# Altium schematic sheet A_Flotador.SchDoc
size A4; DocumentNumber: 1; SheetNumber: 1; SheetTotal: 1
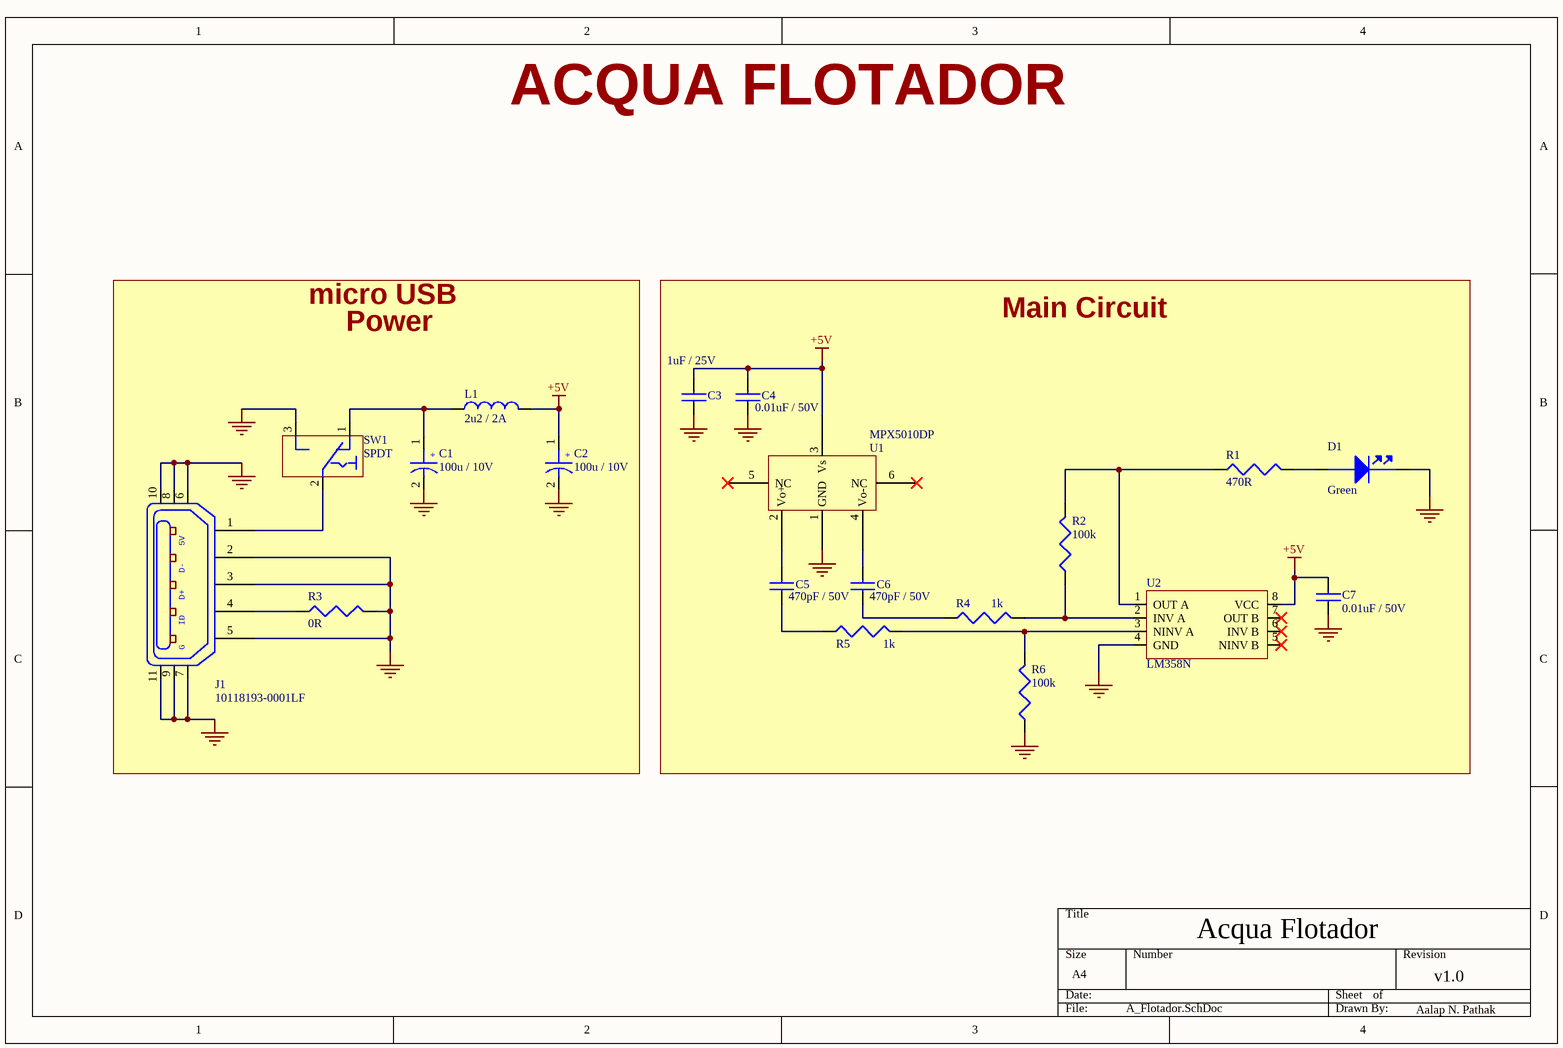
[diagram p0: A_Flotador.SchDoc]

## Parts
C1  100u / 10V  [C_ALU_C_SIZE]
C2  100u / 10V  [C_ALU_C_SIZE]
C3  1uF / 25V  [C0805]
C4  0.01uF / 50V  [C0805]
C5  470pF / 50V  [C0805]
C6  470pF / 50V  [C0805]
C7  0.01uF / 50V  [C0805]
D1  Green  [LED_0603]
J1  10118193-0001LF  [MicroUSB]
L1  2u2 / 2A  [C1210_IND]
R1  470R  [R0805]
R2  100k  [R0805]
R3  0R  [R0805]
R4  1k  [R0805]
R5  1k  [R0805]
R6  100k  [R0805]
SW1  SPDT  [SPDT]
U1  MPX5010DP  [MPX5010DP]
U2  LM358N  [LM358N]

## Blocks framed on the sheet
Main Circuit: C3-C7 D1 R1 R2 R4-R6 U1 U2

## Nets
+5V: C2.1 C3.2 C4.2 C7.2 L1.2 U1.3(Vs) U2.8(VCC)
GND: C1.2 C2.2 C3.1 C4.1 C7.1 D1.1(Cathode) J1.2 J1.3 J1.5 J1.6 J1.7 J1.8 J1.9 J1.10 J1.11 R3.2 R6.1 SW1.3 U1.1(GND) U2.4(GND)
NetC1_1: C1.1 L1.1 SW1.1
NetC5_1: C5.1 R5.1
NetC5_2: C5.2 U1.2(Vo+)
NetC6_1: C6.1 R4.1
NetC6_2: C6.2 U1.4(Vo-)
NetD1_2: D1.2(Anode) R1.2
NetJ1_1: J1.1 SW1.2
NetJ1_4: J1.4 R3.1
NetR1_1: R1.1 R2.2 U2.1(OUT_A)
NetR2_1: R2.1 R4.2 U2.2(INV_A)
NetR5_2: R5.2 R6.2 U2.3(NINV_A)

Not connected (* = marked no-connect by the designer): U1 5(NC)* 6(NC)*; U2 5(NINV_B)* 6(INV_B)* 7(OUT_B)*

## Notes on the sheet
- ACQUA FLOTADOR
- micro USB
- Power
- Acqua Flotador
- v1.0
- Aalap N. Pathak
- (in symbol 10118193-0001LF) 5V; D-; D+; ID; G
- (in symbol EEE-1AA101WR) +

## Library data of the parts
C1 C2 = EEE-1AA101WR: Cap Aluminum 100uF 10V 20% (5 X 5.4mm) SMD 50mA 1000 hr 85°C T/R; Manufacturer: Panasonic; Life (Hours): 1000Hour; Supplier 1: Digi-Key; Supplier Part Number 1: PCE3867CT-ND; Manufacturer Part Number: EEE-1AA101WR; Stock 1: 121782; Pricing 1: 1 = 0.32000, 10 = 0.22100, 100 = 0.13280, 500 = 0.09964 (USD); RoHS: Yes; Mount: Surface Mount,PCB; Case/Package: Radial; Contact Plating: Tin; Min Operating Temperature: -40°C; Max Operating Temperature: 85°C; Capacitance: 100uF; Tolerance: 20%; Ripple Current: 50mA; Voltage Rating: 10V; Packaging: Tape and Reel; Package Quantity: 1; Voltage Rating (DC): 10V; Termination: SMD/SMT; Ripple Current (AC): 50mA; Diameter: 5mm; Length: 5.5mm; Height: 5.4mm; Height - Seated (Max): 0.213inch; Radiation Hardening: No; Lead Free: Lead Free; REACH SVHC: Unknown; ComponentLink1URL: https://datasheet.ciiva.com/26945/getdatasheetpartid-169213-26945071.pdf?src-supplier=Verical; ComponentLink1Description: https://datasheet.ciiva.com/26945/getdatasheetpartid-169213-26945071.pdf?src-supplier=Verical; ComponentLink2URL: https://datasheet.ciiva.com/2983/aba0000ce2-2983906.pdf?src-supplier=Avnet; ComponentLink2Description: https://datasheet.ciiva.com/2983/aba0000ce2-2983906.pdf?src-supplier=Avnet; ComponentLink3URL: https://datasheet.ciiva.com/24027/aba0000ce2-40801-24027541.pdf?src-supplier=Mouser; ComponentLink3Description: https://datasheet.ciiva.com/24027/aba0000ce2-40801-24027541.pdf?src-supplier=Mouser; ComponentLink4URL: https://datasheet.ciiva.com/30075/11aba0000ce2-30075303.pdf?src-supplier=Onlinecomponents.com; ComponentLink4Description: https://datasheet.ciiva.com/30075/11aba0000ce2-30075303.pdf?src-supplier=Onlinecomponents.com; ComponentLink5URL: https://datasheet.ciiva.com/16427/aba0000ce2-16427544.pdf?src-supplier=Future+Electronics; ComponentLink5Description: https://datasheet.ciiva.com/16427/aba0000ce2-16427544.pdf?src-supplier=Future+Electronics; ComponentLink6URL: https://datasheet.ciiva.com/14598/70255710-14598233.pdf?src-supplier=Allied+Electronics; ComponentLink6Description: https://datasheet.ciiva.com/14598/70255710-14598233.pdf?src-supplier=Allied+Electronics; ComponentLink7URL: https://datasheet.ciiva.com/14605/70255710-14605689.pdf?src-supplier=Allied+Electronics; ComponentLink7Description: https://datasheet.ciiva.com/14605/70255710-14605689.pdf?src-supplier=Allied+Electronics; ComponentLink8URL: https://datasheet.ciiva.com/11673/aba0000ce2-11673882.pdf?src-supplier=Avnet; ComponentLink8Description: https://datasheet.ciiva.com/11673/aba0000ce2-11673882.pdf?src-supplier=Avnet
C3 = C2012X5R1E105K125AA: CAP CER 1UF 25V X5R 0805; Manufacturer: TDK; Dielectric Material: Ceramic; Tolerance: 10%; Supplier 1: Digi-Key; Supplier Part Number 1: 445-1419-1-ND; Manufacturer Part Number: C2012X5R1E105K125AA; Stock 1: 57325; Pricing 1: 1 = 0.27000, 10 = 0.18200, 100 = 0.09230, 500 = 0.06314, 1000 = 0.05586 (USD); RoHS: Yes; Mount: Surface Mount; Case/Package: 0805; Number of Pins: 2; Weight: 0.000194oz; Case Code (Metric): 2012; Case Code (Imperial): 0805; Min Operating Temperature: -55°C; Max Operating Temperature: 85°C; Capacitance: 1uF; Voltage Rating: 25V; Packaging: Tape and Reel; Voltage Rating (DC): 25V; Dielectric: X5R; Termination: SMD/SMT; Package Quantity: 2000; Composition: Ceramic; Voltage: 25V; Length: 2mm; Height: 1.25mm; Depth: 1.25mm; Width: 0.049inch; Thickness: 0.057inch; Radiation Hardening: No; Lead Free: Lead Free; REACH SVHC: No SVHC; ComponentLink1URL: https://datasheet.ciiva.com/11787/0900766b80c1bb00-11787608.pdf?src-supplier=RSComponents; ComponentLink1Description: https://datasheet.ciiva.com/11787/0900766b80c1bb00-11787608.pdf?src-supplier=RSComponents; ComponentLink2URL: https://datasheet.ciiva.com/16449/e412-c-16449595.pdf?src-supplier=Future+Electronics; ComponentLink2Description: https://datasheet.ciiva.com/16449/e412-c-16449595.pdf?src-supplier=Future+Electronics; ComponentLink3URL: https://datasheet.ciiva.com/28602/1744655-28602171.pdf?src-supplier=Element14; ComponentLink3Description: https://datasheet.ciiva.com/28602/1744655-28602171.pdf?src-supplier=Element14; ComponentLink4URL: https://datasheet.ciiva.com/15192/getdatasheetpartid-726707-15192140.pdf?src-supplier=Verical; ComponentLink4Description: https://datasheet.ciiva.com/15192/getdatasheetpartid-726707-15192140.pdf?src-supplier=Verical
C4 C7 = C0805C103K5RACTU: CAP CER 0.01UF 50V X7R 0805; Manufacturer: KEMET; Capacitance: 10nF; Tolerance: 10%; Supplier 1: Digi-Key; Supplier Part Number 1: 399-1158-1-ND; Manufacturer Part Number: C0805C103K5RACTU; Stock 1: 3202760; Pricing 1: 1 = 0.15000, 10 = 0.10500, 100 = 0.04950, 500 = 0.03474, 1000 = 0.02876 (USD); RoHS: Yes; Mount: Surface Mount; Case/Package: 0805; Case Code (Imperial): 0805; Case Code (Metric): 2012; Contact Plating: Tin,Matte; Min Operating Temperature: -55°C; Max Operating Temperature: 125°C; Packaging: Tape and Reel; Voltage Rating (DC): 50V; Dielectric: X7R; Package Quantity: 4000; Voltage Rating: 50V; Termination: SMD/SMT; Voltage: 50V; Length: 2mm; Height: 0.78mm; Width: 1.2mm; Lead Pitch: 0.75mm; Depth: 1.25mm; Radiation Hardening: No; ComponentLink1URL: http://www.onlinecomponents.com/productFiles/mf-KEM/kem_c1002_x7r_smd.pdf?src-supplier=Onlinecomponents.com; ComponentLink1Description: http://www.onlinecomponents.com/productFiles/mf-KEM/kem_c1002_x7r_smd.pdf?src-supplier=Onlinecomponents.com; ComponentLink2URL: http://components.arrow.com/part/dataview/0323_00011329?src-supplier=Arrow+Europe; ComponentLink2Description: http://components.arrow.com/part/dataview/0323_00011329?src-supplier=Arrow+Europe; ComponentLink3URL: https://www.verical.com/server-webapp/html/getDatasheet?partID=293414&src-supplier=Verical; ComponentLink3Description: https://www.verical.com/server-webapp/html/getDatasheet?partID=293414&src-supplier=Verical; ComponentLink4URL: http://www.farnell.com/datasheets/2315425.pdf?src-supplier=Farnell; ComponentLink4Description: http://www.farnell.com/datasheets/2315425.pdf?src-supplier=Farnell; ComponentLink5URL: http://www.kemet.com/Lists/ProductCatalog/Attachments/53/KEM_C1002_X7R_SMD.pdf?src-supplier=Avnet; ComponentLink5Description: http://www.kemet.com/Lists/ProductCatalog/Attachments/53/KEM_C1002_X7R_SMD.pdf?src-supplier=Avnet; ComponentLink6URL: http://www.farnell.com/datasheets/2121238.pdf?src-supplier=Element14; ComponentLink6Description: http://www.farnell.com/datasheets/2121238.pdf?src-supplier=Element14; ComponentLink7URL: https://api.kemet.com/component-edge/download/datasheet/C0805C103K5RACTU.pdf?src-supplier=Digi-Key; ComponentLink7Description: https://api.kemet.com/component-edge/download/datasheet/C0805C103K5RACTU.pdf?src-supplier=Digi-Key
C5 C6 = C0805C471K5RACTU: CAP CER 470PF 50V X7R 0805; Manufacturer: KEMET; Dielectric Material: Ceramic; Tolerance: 10%; Dissipation Factor: 2.5%; Supplier 1: Digi-Key; Supplier Part Number 1: 399-1142-1-ND; Manufacturer Part Number: C0805C471K5RACTU; Stock 1: 229830; Pricing 1: 1 = 0.12000, 10 = 0.09000, 100 = 0.04030, 500 = 0.02876, 1000 = 0.02260 (USD); RoHS: Yes; Mount: Surface Mount; Case/Package: 0805; Number of Pins: 2; Case Code (Imperial): 0805; Case Code (Metric): 2012; Min Operating Temperature: -55°C; Max Operating Temperature: 125°C; Capacitance: 470pF; Packaging: Tape and Reel; Dielectric: X7R; Termination: SMD/SMT; Voltage Rating (DC): 50V; Package Quantity: 1; Voltage Rating: 50V; Voltage: 50V; Length: 2mm; Height: 0.78mm; Width: 1.2mm; Lead Pitch: 0.75mm; Depth: 1.25mm; Thickness: 0.035inch; Radiation Hardening: No; REACH SVHC: No SVHC; ComponentLink1URL: https://datasheet.ciiva.com/16624/datasheetpn-c0805c471k5ractu-16624899.pdf?src-supplier=Avnet+Europe; ComponentLink1Description: https://datasheet.ciiva.com/16624/datasheetpn-c0805c471k5ractu-16624899.pdf?src-supplier=Avnet+Europe; ComponentLink2URL: https://datasheet.ciiva.com/18193/getdatasheetpartid-344591-18193834.pdf?src-supplier=Verical; ComponentLink2Description: https://datasheet.ciiva.com/18193/getdatasheetpartid-344591-18193834.pdf?src-supplier=Verical; ComponentLink3URL: https://datasheet.ciiva.com/46446/1851736-46446251.pdf?src-supplier=Element14; ComponentLink3Description: https://datasheet.ciiva.com/46446/1851736-46446251.pdf?src-supplier=Element14; ComponentLink4URL: https://datasheet.ciiva.com/28614/kem-c1002-x7r-smd-28614760.pdf?src-supplier=Element14; ComponentLink4Description: https://datasheet.ciiva.com/28614/kem-c1002-x7r-smd-28614760.pdf?src-supplier=Element14
D1 = LGL29K-G2J1-24-Z: LED Uni-Color Green 572nm 2-Pin Chip 0603(1608Metric) T/R; Manufacturer: Osram Opto; Lens Color: White; Forward Current: 20mA; Forward Voltage: 2.2V; Luminous Intensity: 5.6mcd; Viewing Angle: 160°; Lens Style: Flat,Diffused,Colorless,Rectangular; Test Current: 2mA; Dominant Wavelength: 570nm; Luminous Flux: 0.012lm; Number of LEDs: 1; Lens Transparency: Diffused; Reverse Voltage: 12V; Lens Size: 0.8mm; Supplier 1: Digi-Key; Supplier Part Number 1: 475-2709-1-ND; Manufacturer Part Number: LGL29K-G2J1-24-Z; Stock 1: 129040; Pricing 1: 1 = 0.50000, 10 = 0.36300, 100 = 0.23730, 500 = 0.17054, 1000 = 0.13347, 2500 = 0.12235 (USD); RoHS: Yes; Mount: Surface Mount; Case/Package: 0603; Number of Pins: 2; Color: Green; Case Code (Metric): 1608; Case Code (Imperial): 0603; Min Operating Temperature: -40°C; Max Operating Temperature: 100°C; Illumination Color: Green; Packaging: Tape and Reel; Package Quantity: 5000; Number of Elements: 1; Length: 1.3mm; Height: 0.65mm; Width: 0.8mm; Depth: 0.8mm; Radiation Hardening: No; ComponentLink1URL: https://datasheet.ciiva.com/4689/g-l29k-39844-4689584.pdf?src-supplier=Mouser; ComponentLink1Description: https://datasheet.ciiva.com/4689/g-l29k-39844-4689584.pdf?src-supplier=Mouser; ComponentLink2URL: https://datasheet.ciiva.com/15198/getdatasheetpartid-571127-15198411.pdf?src-supplier=Verical; ComponentLink2Description: https://datasheet.ciiva.com/15198/getdatasheetpartid-571127-15198411.pdf?src-supplier=Verical; ComponentLink3URL: https://datasheet.ciiva.com/2112/00077107-0-2112887.pdf?src-supplier=Digi-Key; ComponentLink3Description: https://datasheet.ciiva.com/2112/00077107-0-2112887.pdf?src-supplier=Digi-Key; ComponentLink4URL: https://datasheet.ciiva.com/2112/00077107-0-2112888.pdf?src-supplier=Digi-Key; ComponentLink4Description: https://datasheet.ciiva.com/2112/00077107-0-2112888.pdf?src-supplier=Digi-Key; ComponentLink5URL: https://datasheet.ciiva.com/2112/00077107-0-2112886.pdf?src-supplier=Digi-Key; ComponentLink5Description: https://datasheet.ciiva.com/2112/00077107-0-2112886.pdf?src-supplier=Digi-Key
J1 = 10118193-0001LF: CONN RCPT USB2.0 MICRO B SMD R/A; Manufacturer: Amphenol FCI; Gender: Female; Connector Type: USB,Receptacle; Number of Contacts: 5; Insulation Resistance: 1GR; Number of Ports: 1; Current Rating: 1.8A; Max Voltage Rating (AC): 100V; Pitch: 0.65mm; Supplier 1: Digi-Key; Supplier Part Number 1: 609-4616-1-ND; Manufacturer Part Number: 10118193-0001LF; Stock 1: 150983; Pricing 1: 1 = 0.43000, 10 = 0.40500, 25 = 0.36440, 50 = 0.32400, 100 = 0.31040, 250 = 0.28344, 500 = 0.26994 (USD); RoHS: Yes; Mount: Surface Mount,Horizontal; Contact Material: Copper Alloy; Contact Plating: Gold; Color: Black; Number of Terminals: 5; Housing Material: Polymer; Min Operating Temperature: -55°C; Max Operating Temperature: 85°C; Termination: Solder; Orientation: Right Angle; Package Quantity: 1200; Packaging: Tape and Reel; Voltage Rating: 100V; Features: Shielded; Length: 7.86mm; Depth: 5.67mm; Radiation Hardening: No; Flammability Rating: UL94 V-0; ComponentLink1URL: https://datasheet.ciiva.com/851/10118193-851106.pdf?src-supplier=Digi-Key; ComponentLink1Description: https://datasheet.ciiva.com/851/10118193-851106.pdf?src-supplier=Digi-Key; ComponentLink2URL: https://datasheet.ciiva.com/14802/10118193-0001lf-webpage-14802386.pdf?src-supplier=Arrow; ComponentLink2Description: https://datasheet.ciiva.com/14802/10118193-0001lf-webpage-14802386.pdf?src-supplier=Arrow; ComponentLink3URL: https://datasheet.ciiva.com/26853/getdatasheetpartid-418618-26853893.pdf?src-supplier=Verical; ComponentLink3Description: https://datasheet.ciiva.com/26853/getdatasheetpartid-418618-26853893.pdf?src-supplier=Verical; ComponentLink4URL: https://datasheet.ciiva.com/4598/10118193ac-197151-4598799.pdf?src-supplier=Mouser; ComponentLink4Description: https://datasheet.ciiva.com/4598/10118193ac-197151-4598799.pdf?src-supplier=Mouser; ComponentLink5URL: https://datasheet.ciiva.com/851/10118193-851107.pdf?src-supplier=Digi-Key; ComponentLink5Description: https://datasheet.ciiva.com/851/10118193-851107.pdf?src-supplier=Digi-Key; ComponentLink6URL: https://datasheet.ciiva.com/851/10118193-851108.pdf?src-supplier=Digi-Key; ComponentLink6Description: https://datasheet.ciiva.com/851/10118193-851108.pdf?src-supplier=Digi-Key; ComponentLink7URL: https://datasheet.ciiva.com/14618/70236827-14618887.pdf?src-supplier=Allied+Electronics; ComponentLink7Description: https://datasheet.ciiva.com/14618/70236827-14618887.pdf?src-supplier=Allied+Electronics
L1 = L1210R2R2MDWIT: FIXED IND 2.2UH 2A 80 MOHM SMD; Manufacturer: KEMET; Core Material: Ferrite; Tolerance: 20%; Shielding: Unshielded; Self Resonant Frequency: 190MHz; DC Resistance (DCR): 80mR; Test Frequency: 100kHz; DC Current: 1.13A; Supplier 1: Digi-Key; Supplier Part Number 1: 399-9598-1-ND; Manufacturer Part Number: L1210R2R2MDWIT; Stock 1: 14739; Pricing 1: 1 = 0.55000, 10 = 0.47900, 100 = 0.34210, 500 = 0.28738 (USD); RoHS: Yes; Mount: Surface Mount; Case/Package: 1210; Case Code (Metric): 3225; Case Code (Imperial): 1210; Min Operating Temperature: -40°C; Max Operating Temperature: 105°C; Inductance: 2.2uH; Max DC Current: 2A; Package Quantity: 1000; Current Rating: 2A; Packaging: Tape and Reel; Inductance Tolerance: 20%; Composition: Wirewound,Ceramic; Termination: SMD/SMT; Military Standard: Not; Length: 0.126inch; Height: 2.5mm; Width: 0.098inch; Height - Seated (Max): 0.106inch; Depth: 2.7mm; Radiation Hardening: No; REACH SVHC: No SVHC; ComponentLink1URL: https://datasheet.ciiva.com/17280/f3115-17280270.pdf?src-supplier=Avnet+Europe; ComponentLink1Description: https://datasheet.ciiva.com/17280/f3115-17280270.pdf?src-supplier=Avnet+Europe; ComponentLink2URL: https://datasheet.ciiva.com/22685/27262-22685038.pdf?src-supplier=Element14; ComponentLink2Description: https://datasheet.ciiva.com/22685/27262-22685038.pdf?src-supplier=Element14; ComponentLink3URL: https://datasheet.ciiva.com/4957/f3115-4957838.pdf?src-supplier=Mouser; ComponentLink3Description: https://datasheet.ciiva.com/4957/f3115-4957838.pdf?src-supplier=Mouser; ComponentLink4URL: https://datasheet.ciiva.com/6691/f3115-6691487.pdf?src-supplier=Digi-Key; ComponentLink4Description: https://datasheet.ciiva.com/6691/f3115-6691487.pdf?src-supplier=Digi-Key; ComponentLink5URL: https://datasheet.ciiva.com/8512/f3115-8512543.pdf?src-supplier=Avnet; ComponentLink5Description: https://datasheet.ciiva.com/8512/f3115-8512543.pdf?src-supplier=Avnet
R1 = RC0805FR-07470RL: RES SMD 470 OHM 1% 1/8W 0805; Manufacturer: Yageo; Temperature Coefficient: 100ppm/°C; Voltage Rating (DC): 150V; Power Rating: 125mW; Supplier 1: Digi-Key; Supplier Part Number 1: 311-470CRCT-ND; Manufacturer Part Number: RC0805FR-07470RL; Stock 1: 1101328; Pricing 1: 1 = 0.10000, 10 = 0.04000, 100 = 0.01630, 1000 = 0.00731, 2500 = 0.00635 (USD); RoHS: Yes; Case/Package: 0805; Number of Pins: 2; Case Code (Metric): 2012; Case Code (Imperial): 0805; Min Operating Temperature: -55°C; Max Operating Temperature: 155°C; Resistance: 470R; Tolerance: 1%; Composition: Thick Film; Packaging: Tape and Reel; Package Quantity: 1; Voltage Rating: 150V; Number of Terminations: 2; Termination: SMD/SMT; Military Standard: Not; Max Power Dissipation: 125mW; Features: Moisture Resistant; Length: 2mm; Height: 0.5mm; Width: 1.25mm; Depth: 1.25mm; Lead Pitch: 0.4mm; REACH SVHC: Unknown; Lead Free: Lead Free; ComponentLink1URL: https://datasheet.ciiva.com/2457/pyu-r-int-thick-7-2457056.pdf?src-supplier=Digi-Key; ComponentLink1Description: https://datasheet.ciiva.com/2457/pyu-r-int-thick-7-2457056.pdf?src-supplier=Digi-Key; ComponentLink2URL: https://datasheet.ciiva.com/2457/pyu-r-int-thick-7-2457057.pdf?src-supplier=Digi-Key; ComponentLink2Description: https://datasheet.ciiva.com/2457/pyu-r-int-thick-7-2457057.pdf?src-supplier=Digi-Key; ComponentLink3URL: https://datasheet.ciiva.com/2457/pyu-r-int-thick-7-2457058.pdf?src-supplier=Digi-Key; ComponentLink3Description: https://datasheet.ciiva.com/2457/pyu-r-int-thick-7-2457058.pdf?src-supplier=Digi-Key; ComponentLink4URL: https://datasheet.ciiva.com/7941/444164-7941797.pdf?src-supplier=Element14; ComponentLink4Description: https://datasheet.ciiva.com/7941/444164-7941797.pdf?src-supplier=Element14; ComponentLink5URL: https://datasheet.ciiva.com/7941/444164-7941798.pdf?src-supplier=Element14; ComponentLink5Description: https://datasheet.ciiva.com/7941/444164-7941798.pdf?src-supplier=Element14; ComponentLink6URL: https://datasheet.ciiva.com/46447/444164-46447580.pdf?src-supplier=Element14; ComponentLink6Description: https://datasheet.ciiva.com/46447/444164-46447580.pdf?src-supplier=Element14; ComponentLink7URL: https://datasheet.ciiva.com/16745/rc0805-16745229.pdf?src-supplier=Future+Electronics; ComponentLink7Description: https://datasheet.ciiva.com/16745/rc0805-16745229.pdf?src-supplier=Future+Electronics
R2 R6 = RC0805FR-07100KL: RES SMD 100K OHM 1% 1/8W 0805; Manufacturer: Yageo; Resistance: 100kR; Temperature Coefficient: 100ppm/°C; Power Rating: 125mW; Voltage Rating (DC): 150V; Supplier 1: Digi-Key; Supplier Part Number 1: 311-100KCRCT-ND; Manufacturer Part Number: RC0805FR-07100KL; Stock 1: 7766985; Pricing 1: 1 = 0.10000, 10 = 0.03800, 100 = 0.01550, 1000 = 0.00694, 2500 = 0.00603 (USD); RoHS: Yes; Case/Package: 0805; Number of Pins: 2; Case Code (Metric): 2012; Case Code (Imperial): 0805; Min Operating Temperature: -55°C; Max Operating Temperature: 155°C; Composition: Thick Film; Tolerance: 1%; Packaging: Tape and Reel; Voltage Rating: 150V; Package Quantity: 1; Number of Terminations: 2; Termination: SMD/SMT; Military Standard: Not; Max Power Dissipation: 125mW; Features: Moisture Resistant; Length: 2mm; Height: 0.024inch; Width: 0.049inch; Depth: 1.25mm; Lead Pitch: 0.4mm; REACH SVHC: Unknown; Lead Free: Lead Free; ComponentLink1URL: https://datasheet.ciiva.com/11808/0900766b8106beab-11808858.pdf?src-supplier=RSComponents; ComponentLink1Description: https://datasheet.ciiva.com/11808/0900766b8106beab-11808858.pdf?src-supplier=RSComponents; ComponentLink2URL: https://datasheet.ciiva.com/2457/pyu-r-int-thick-7-2457017.pdf?src-supplier=Digi-Key; ComponentLink2Description: https://datasheet.ciiva.com/2457/pyu-r-int-thick-7-2457017.pdf?src-supplier=Digi-Key; ComponentLink3URL: https://datasheet.ciiva.com/12667/rc0805-12667001.pdf?src-supplier=Mouser; ComponentLink3Description: https://datasheet.ciiva.com/12667/rc0805-12667001.pdf?src-supplier=Mouser; ComponentLink4URL: https://datasheet.ciiva.com/2457/pyu-r-int-thick-7-2457018.pdf?src-supplier=Digi-Key; ComponentLink4Description: https://datasheet.ciiva.com/2457/pyu-r-int-thick-7-2457018.pdf?src-supplier=Digi-Key; ComponentLink5URL: https://datasheet.ciiva.com/16747/rc0805-16747226.pdf?src-supplier=Future+Electronics; ComponentLink5Description: https://datasheet.ciiva.com/16747/rc0805-16747226.pdf?src-supplier=Future+Electronics; ComponentLink6URL: https://datasheet.ciiva.com/2457/pyu-r-int-thick-7-2457019.pdf?src-supplier=Digi-Key; ComponentLink6Description: https://datasheet.ciiva.com/2457/pyu-r-int-thick-7-2457019.pdf?src-supplier=Digi-Key; ComponentLink7URL: https://datasheet.ciiva.com/7660/38627-7660796.pdf?src-supplier=Element14; ComponentLink7Description: https://datasheet.ciiva.com/7660/38627-7660796.pdf?src-supplier=Element14; ComponentLink8URL: https://datasheet.ciiva.com/7941/1697719-7941676.pdf?src-supplier=Element14; ComponentLink8Description: https://datasheet.ciiva.com/7941/1697719-7941676.pdf?src-supplier=Element14; ComponentLink9URL: https://datasheet.ciiva.com/7941/1686128-7941677.pdf?src-supplier=Element14; ComponentLink9Description: https://datasheet.ciiva.com/7941/1686128-7941677.pdf?src-supplier=Element14; ComponentLink10URL: https://datasheet.ciiva.com/7941/1697719-7941678.pdf?src-supplier=Element14; ComponentLink10Description: https://datasheet.ciiva.com/7941/1697719-7941678.pdf?src-supplier=Element14; ComponentLink11URL: https://datasheet.ciiva.com/22747/444164-22747534.pdf?src-supplier=Element14; ComponentLink11Description: https://datasheet.ciiva.com/22747/444164-22747534.pdf?src-supplier=Element14
R3 = RC0805JR-070RL: RES SMD 0 OHM JUMPER 1/8W 0805; Manufacturer: Yageo; Resistance: 0mR; Tolerance: 5%; Power Rating: 125mW; Voltage Rating: 150V; Temperature Coefficient: 200ppm/°C; Supplier 1: Digi-Key; Supplier Part Number 1: 311-0.0ARCT-ND; Manufacturer Part Number: RC0805JR-070RL; Stock 1: 13963017; Pricing 1: 1 = 0.10000, 10 = 0.03800, 25 = 0.02760, 50 = 0.02100, 100 = 0.01540, 250 = 0.01180, 500 = 0.00942, 1000 = 0.00694 (USD); RoHS: Yes; Case/Package: 0805; Number of Pins: 2; Contact Plating: Tin,Matte; Case Code (Imperial): 0805; Case Code (Metric): 2012; Min Operating Temperature: -55°C; Max Operating Temperature: 155°C; Composition: Thick Film; Packaging: Tape and Reel; Voltage Rating (DC): 150V; Termination: SMD/SMT; Military Standard: Not; Length: 2mm; Height: 0.5mm; Width: 1.25mm; Depth: 1.25mm; Radiation Hardening: No; REACH SVHC: Unknown; Lead Free: Lead Free; ComponentLink1URL: https://datasheet.ciiva.com/7941/1738694-7941861.pdf?src-supplier=Element14; ComponentLink1Description: https://datasheet.ciiva.com/7941/1738694-7941861.pdf?src-supplier=Element14; ComponentLink2URL: https://datasheet.ciiva.com/11819/0900766b8106beab-11819430.pdf?src-supplier=RSComponents; ComponentLink2Description: https://datasheet.ciiva.com/11819/0900766b8106beab-11819430.pdf?src-supplier=RSComponents; ComponentLink3URL: https://datasheet.ciiva.com/7941/1738694-7941862.pdf?src-supplier=Element14; ComponentLink3Description: https://datasheet.ciiva.com/7941/1738694-7941862.pdf?src-supplier=Element14; ComponentLink4URL: https://datasheet.ciiva.com/7941/1738694-7941863.pdf?src-supplier=Element14; ComponentLink4Description: https://datasheet.ciiva.com/7941/1738694-7941863.pdf?src-supplier=Element14; ComponentLink5URL: https://datasheet.ciiva.com/15190/getdatasheetpartid-330685-15190028.pdf?src-supplier=Verical; ComponentLink5Description: https://datasheet.ciiva.com/15190/getdatasheetpartid-330685-15190028.pdf?src-supplier=Verical
R4 R5 = RC0805FR-071KL: RES SMD 1K OHM 1% 1/8W 0805; Manufacturer: Yageo Phycomp; Temperature Coefficient: 100ppm/°C; Resistance: 1000R; Voltage Rating (DC): 150V; Power Rating: 125mW; Supplier 1: Digi-Key; Supplier Part Number 1: 311-1.00KCRCT-ND; Manufacturer Part Number: RC0805FR-071KL; Stock 1: 26091057; Pricing 1: 1 = 0.10000, 10 = 0.03700, 100 = 0.01490, 1000 = 0.00668, 2500 = 0.00580 (USD); RoHS: Yes; Mount: Surface Mount; Case/Package: 0805; Number of Pins: 2; Min Operating Temperature: -55°C; Max Operating Temperature: 155°C; Tolerance: 1%; Packaging: Cut Tape; Length: 2mm; Height: 0.5mm; Width: 1.25mm; Depth: 1.25mm; REACH SVHC: No SVHC; Lead Free: Lead Free; ComponentLink1URL: http://www.farnell.com/datasheets/2167052.pdf?src-supplier=Farnell; ComponentLink1Description: http://www.farnell.com/datasheets/2167052.pdf?src-supplier=Farnell; ComponentLink2URL: http://www.mouser.com/ds/2/447/Yageo_08112016_RC0805-968729.pdf?src-supplier=Mouser; ComponentLink2Description: http://www.mouser.com/ds/2/447/Yageo_08112016_RC0805-968729.pdf?src-supplier=Mouser; ComponentLink3URL: http://www.yageo.com/documents/recent/PYu-RC_Group_51_RoHS_L_10.pdf?src-supplier=Digi-Key; ComponentLink3Description: http://www.yageo.com/documents/recent/PYu-RC_Group_51_RoHS_L_10.pdf?src-supplier=Digi-Key; ComponentLink4URL: http://www.farnell.com/datasheets/2167052.pdf?src-supplier=Newark; ComponentLink4Description: http://www.farnell.com/datasheets/2167052.pdf?src-supplier=Newark; ComponentLink5URL: http://www.farnell.com/datasheets/1697719.pdf?src-supplier=Element14; ComponentLink5Description: http://www.farnell.com/datasheets/1697719.pdf?src-supplier=Element14
SW1 = OS102011MS2QN1: C & K COMPONENTS         OS102011MS2QN1             Slide Switch, SPDT, On-On, Through Hole, OS Series, 100 mA; Manufacturer: ITT C&K; Mechanical Life: 10000Cycles; Actuator Material: Polyoxymethylene,Acetal,Polyacetal; Max Voltage Rating (DC): 12V; Max Current Rating: 100mA; Contact Resistance: 20mR; Insulation Resistance: 100MR; Switch Travel: 2mm; Actuator Type: Standard; Actuator Length: 4mm; Supplier 1: Digi-Key; Supplier Part Number 1: CKN9565-ND; Manufacturer Part Number: OS102011MS2QN1; Stock 1: 21108; Pricing 1: 1 = 0.43000, 10 = 0.41300, 25 = 0.40480, 50 = 0.36160, 100 = 0.34440, 250 = 0.33580, 500 = 0.28414, 1000 = 0.27552, 5000 = 0.24108 (USD); RoHS: Yes; Mount: Through Hole,PCB; Contact Material: Copper Alloy,Brass,Silver; Contact Plating: Silver,Gold; Housing Material: Resin; Min Operating Temperature: -30°C; Max Operating Temperature: 70°C; Throw Configuration: SPDT; Termination: PC Pins; Packaging: Bulk; Electrical Life: 10000Cycles; Orientation: Vertical; Voltage Rating (DC): 12V; Package Quantity: 300; Contact Current Rating: 100mA; Current Rating: 100mA; Switch Function: On-On; Length: 8.6mm; Depth: 4.3mm; Radiation Hardening: No; REACH SVHC: No SVHC; Lead Free: Lead Free; ComponentLink1URL: https://datasheet.ciiva.com/30466/0900766b81263f61-30466806.pdf?src-supplier=RSComponents; ComponentLink1Description: https://datasheet.ciiva.com/30466/0900766b81263f61-30466806.pdf?src-supplier=RSComponents; ComponentLink2URL: https://datasheet.ciiva.com/16298/os102011ms2qn1-16298526.pdf?src-supplier=Future+Electronics; ComponentLink2Description: https://datasheet.ciiva.com/16298/os102011ms2qn1-16298526.pdf?src-supplier=Future+Electronics; ComponentLink3URL: https://datasheet.ciiva.com/1532/1683358-1532308.pdf?src-supplier=Element14; ComponentLink3Description: https://datasheet.ciiva.com/1532/1683358-1532308.pdf?src-supplier=Element14; ComponentLink4URL: https://datasheet.ciiva.com/2889/os-19jan15-2889173.pdf?src-supplier=Digi-Key; ComponentLink4Description: https://datasheet.ciiva.com/2889/os-19jan15-2889173.pdf?src-supplier=Digi-Key; ComponentLink5URL: https://datasheet.ciiva.com/1699/os-19jan15-1699479.pdf?src-supplier=Newark; ComponentLink5Description: https://datasheet.ciiva.com/1699/os-19jan15-1699479.pdf?src-supplier=Newark; ComponentLink6URL: https://datasheet.ciiva.com/18147/getdatasheetpartid-320490-18147210.pdf?src-supplier=Verical; ComponentLink6Description: https://datasheet.ciiva.com/18147/getdatasheetpartid-320490-18147210.pdf?src-supplier=Verical; ComponentLink7URL: https://datasheet.ciiva.com/16997/70128245-16997771.pdf?src-supplier=Allied+Electronics; ComponentLink7Description: https://datasheet.ciiva.com/16997/70128245-16997771.pdf?src-supplier=Allied+Electronics; ComponentLink8URL: https://datasheet.ciiva.com/26290/os-11mar13-26290652.pdf?src-supplier=Onlinecomponents.com; ComponentLink8Description: https://datasheet.ciiva.com/26290/os-11mar13-26290652.pdf?src-supplier=Onlinecomponents.com
U1 = MPX5010DP: NXP         MPX5010DP             Pressure Sensor, Differential, 450 mV/kPa, 0 kPa, 10 kPa, 4.75 V, 5.25 V; Manufacturer: NXP Freescale; Nominal Supply Current: 5mA; Output Voltage: 4.7V; Operating Supply Voltage: 5V; Min Supply Voltage: 4.75V; Max Supply Voltage: 5.25V; Operating Pressure: 1.45PSI; Port Style: Barbed; Max Pressure: 5.8PSI; Accuracy: 5%; Response Time: 1ms; Output Type: Analog Voltage,Analog; Supplier 1: Digi-Key; Supplier Part Number 1: MPX5010DP-ND; Manufacturer Part Number: MPX5010DP; Stock 1: 0; Pricing 1: 1 = 16.33000, 10 = 13.33200, 25 = 12.33200, 100 = 10.33230, 500 = 9.66570, 1000 = 9.16575 (USD); RoHS: Yes; Mount: Through Hole; Case/Package: SIP; Number of Pins: 6; Weight: 0.184887oz; Min Operating Temperature: -40°C; Max Operating Temperature: 125°C; Packaging: Tray; Package Quantity: 100; Termination: PCB; Pressure Type: Differential; Radiation Hardening: No; REACH SVHC: No SVHC; Lead Free: Lead Free; Halogen Free: Not Halogen Free; ComponentLink1URL: https://datasheet.ciiva.com/14094/rkmotorola-drucksensor-en-14094760.pdf?src-supplier=Distrelec; ComponentLink1Description: https://datasheet.ciiva.com/14094/rkmotorola-drucksensor-en-14094760.pdf?src-supplier=Distrelec; ComponentLink2URL: https://datasheet.ciiva.com/26929/mpx5010dp-26929428.pdf?src-supplier=IIIC; ComponentLink2Description: https://datasheet.ciiva.com/26929/mpx5010dp-26929428.pdf?src-supplier=IIIC; ComponentLink3URL: https://datasheet.ciiva.com/2825/mpx5010-2825379.pdf?src-supplier=Digi-Key; ComponentLink3Description: https://datasheet.ciiva.com/2825/mpx5010-2825379.pdf?src-supplier=Digi-Key; ComponentLink4URL: https://datasheet.ciiva.com/16373/mpx5010-16373114.pdf?src-supplier=Future+Electronics; ComponentLink4Description: https://datasheet.ciiva.com/16373/mpx5010-16373114.pdf?src-supplier=Future+Electronics; ComponentLink5URL: https://datasheet.ciiva.com/1513/1738898-1513837.pdf?src-supplier=Element14; ComponentLink5Description: https://datasheet.ciiva.com/1513/1738898-1513837.pdf?src-supplier=Element14
U2 = LM358N/NOPB: IC OPAMP GP 1MHZ 8DIP; Manufacturer: TI National Semiconductor; Slew Rate: 0.1V/µs; Operating Supply Voltage: 16V; Max Supply Voltage: 32V; Min Supply Voltage: 3V; Nominal Supply Current: 500uA; Common Mode Rejection Ratio: 65dB; Voltage Gain: 100dB; Min Dual Supply Voltage: 1.5V; Max Power Dissipation: 830mW; Number of Channels: 2; Output Current: 30mA; Input Bias Current: 250nA; Input Offset Voltage (Vos): 7mV; Output Current per Channel: 40mA; Max Supply Current: 1.2mA; Operating Supply Current: 1mA; Supplier 1: Digi-Key; Supplier Part Number 1: LM358NNS/NOPB-ND; Manufacturer Part Number: LM358N/NOPB; Stock 1: 3167; Pricing 1: 1 = 0.84000, 10 = 0.75500, 25 = 0.71680, 100 = 0.55040, 500 = 0.46080, 1000 = 0.35840, 2500 = 0.34048, 5000 = 0.32768 (USD); RoHS: Yes; Mount: Through Hole; Case/Package: PDIP; Number of Pins: 8; Weight: 0.01lb; Min Operating Temperature: 0°C; Max Operating Temperature: 70°C; Bandwidth: 1MHz; Packaging: Rail/Tube; Unity Gain Bandwidth Product: 1MHz; Max Dual Supply Voltage: 16V; Number of Circuits: 2; Gain Bandwidth Product: 1MHz; Number of Amplifiers: 2; Number of Elements: 2; Power Dissipation: 830mW; Power Supply Rejection Ratio (PSRR): 65dB; Package Quantity: 40; Length: 9.27mm; Height: 3.3mm; Width: 6.35mm; Radiation Hardening: No; REACH SVHC: No SVHC; Lead Free: Lead Free; ComponentLink1URL: https://datasheet.ciiva.com/19474/839367-19474437.pdf?src-supplier=Jameco; ComponentLink1Description: https://datasheet.ciiva.com/19474/839367-19474437.pdf?src-supplier=Jameco; ComponentLink2URL: https://datasheet.ciiva.com/22769/1696812-22769451.pdf?src-supplier=Farnell; ComponentLink2Description: https://datasheet.ciiva.com/22769/1696812-22769451.pdf?src-supplier=Farnell; ComponentLink3URL: https://datasheet.ciiva.com/26850/lm358n-nopb-26850548.pdf?src-supplier=IIIC; ComponentLink3Description: https://datasheet.ciiva.com/26850/lm358n-nopb-26850548.pdf?src-supplier=IIIC; ComponentLink4URL: https://datasheet.ciiva.com/2973/lm2904-n-2973398.pdf?src-supplier=Avnet; ComponentLink4Description: https://datasheet.ciiva.com/2973/lm2904-n-2973398.pdf?src-supplier=Avnet; ComponentLink5URL: https://datasheet.ciiva.com/8009/28655-8009196.pdf?src-supplier=Element14; ComponentLink5Description: https://datasheet.ciiva.com/8009/28655-8009196.pdf?src-supplier=Element14; ComponentLink6URL: https://datasheet.ciiva.com/14151/ohlmx58-lm2904-e-14151404.pdf?src-supplier=Distrelec; ComponentLink6Description: https://datasheet.ciiva.com/14151/ohlmx58-lm2904-e-14151404.pdf?src-supplier=Distrelec; ComponentLink7URL: https://datasheet.ciiva.com/6625/lm158-n-6625621.pdf?src-supplier=Digi-Key; ComponentLink7Description: https://datasheet.ciiva.com/6625/lm158-n-6625621.pdf?src-supplier=Digi-Key; ComponentLink8URL: https://datasheet.ciiva.com/26061/lm2904-n-26061750.pdf?src-supplier=Avnet+Europe; ComponentLink8Description: https://datasheet.ciiva.com/26061/lm2904-n-26061750.pdf?src-supplier=Avnet+Europe